# Altium schematic sheet PWM.SchDoc
size A4; SheetNumber: 2; SheetTotal: 4
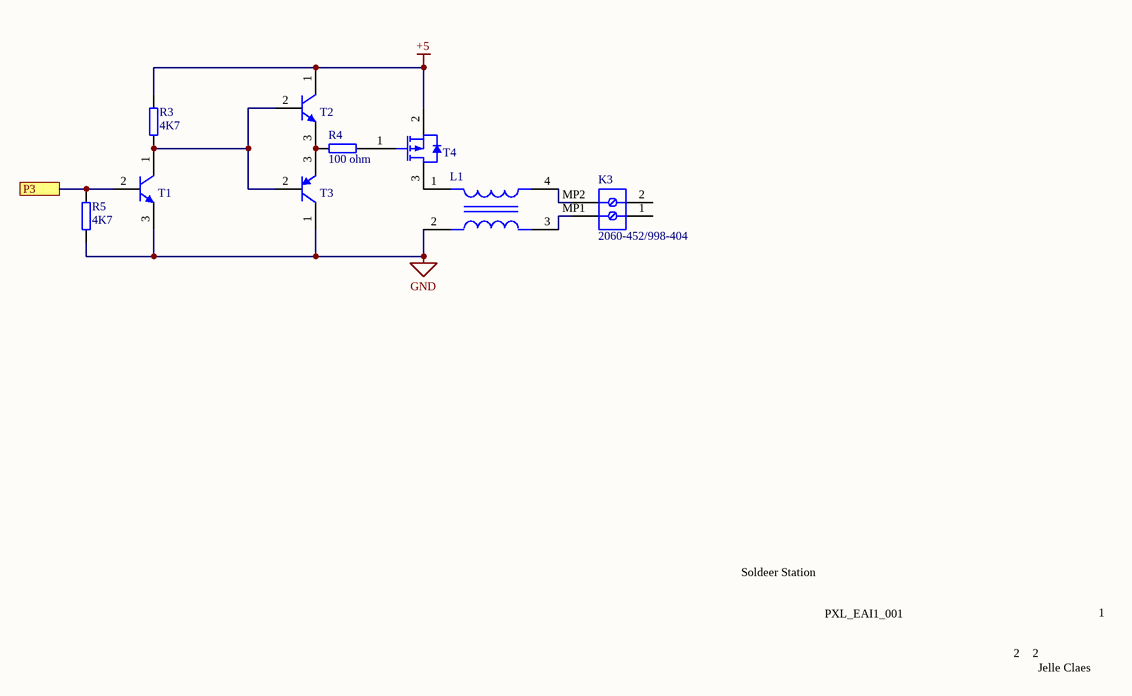
[diagram p0: PWM.SchDoc]

## Parts
K3  2060-452/998-404  [WAGO-2060-452_V]
L1  Common_Mode_Choke  [2545]  (value not drawn)
R3  4K7  [R_0805_M]
R4  100 ohm  [R_0805_M]
R5  4K7  [R_0805_M]
T1  Transistor_NPN  [SOT_23]  (value not drawn)
T2  Transistor_NPN  [SOT_23]  (value not drawn)
T3  Transistor_PNP  [SOT_23]  (value not drawn)
T4  MOSFET_P  [TO_252]  (value not drawn)

## Ports
P3 (see CPU[2B])

## Nets
+5: R3.2 T2.1(C) T4.2(DRAIN)
GND: L1.2 R5.1 T1.3(E) T3.1(C)
P3: R5.2 T1.2(B) ; port P3
NetK3_MP1: K3.MP1 L1.3
NetK3_MP2: K3.MP2 L1.4
NetL1_1: L1.1 T4.3(SOURCE)
NetR3_1: R3.1 T1.1(C) T2.2(B) T3.2(B)
NetR4_1: R4.1 T4.1(GATE)
NetR4_2: R4.2 T2.3(E) T3.3(E)

Not connected (* = marked no-connect by the designer): K3 1 2

## Notes on the sheet
- Soldeer Station
- PXL_EAI1_001
- 2
- 1
- Jelle Claes

## Library data of the parts
K3 = WAGO-2060: Terminal Block, Pitch 4 mm, 1 x 2 Position, Height 4.5 mm, -60 to 105 degC, RoHS, Tape and Reel; Manufacturer: WAGO; Number of contacts: 2; Content: 1pc(s); Min. cross section (flexible): 0.25mm²; Stripping length: 6-7mm; Nominal current: 9A; Nominal voltage: 160V; Pitch: 4mm; Min. cross section (unflexible): 0.2mm²; Max. cross section (inflexible): 0.75mm²; AWG: 24-18; Connection: Pullspring; Type: 2060-452/998-404; Package Reference: 2060-452; Mounting Technology: SurfaceMount; Colour: White; Package Description: Terminal Block, Pitch 4 mm, 1 x 2 Position, Height 4.5 mm; Height: 4.5mm; Manufacturer URL: http://global.wago.com/en/index-en.jsp; Material: PPA-GFenclosure·Tin-platedcoppercontacts; Width: 10.1mm; Manufacturer part No.: 2060-452/998-404; Datasheet URL: http://www.wago.com/infomaterial/pdf/60255126.pdf; Contact material: Tinplated; Length: 7.9mm; Max. cross section (flexible): 0.75mm²; Datasheet Version: 03/2015
L1 = Common_Mode_Choke: Max Current Rating: 2A; Number of Lines: 2; Impedance: 900R; Element Configuration: Dual; Insulation Resistance: 10MR; Test Frequency: 100MHz; DC Resistance (DCR): 60mR; Voltage Rating (DC): 50V; Current Rating: 2.3A; Number of Pins: 4; DC Current: 2A; Mount: Surface Mount; Current: 2A; REACH SVHC: No SVHC; Width: 4.5mm; Case/Package: 1808; Voltage Rating: 50V; Package Quantity: 1; Height: 2mm; Max DC Current: 2A; Packaging: Tape and Reel; Max Operating Temperature: 85°C; Lead Free: Lead Free; Length: 0.185inch; Series: ACM; Radiation Hardening: No; Max Voltage Rating (DC): 50V; Termination: Flat; Depth: 4.7mm; RoHS Compliant: Yes; DC Resistance-Max: 60mR; Min Operating Temperature: -40°C
R3-R5 = Resistor: Manufacturer: Vishay Dale; Part Number: CRCW08050000Z0EA
T1 T2 = Transistor_NPN: Manufacturer: On Semiconductor; PartNumber: BC547C; IC Continuous (A): 0.1; fT Min (MHz): 150; Packing: Bulk Box; Polarity: NPN; Mounting Technology: Through Hole; ComponentLink1URL: http://www.onsemi.com/; ComponentLink1Description: Manufacturer URL; ComponentLink3URL: http://www.onsemi.cn/pub_link/Collateral/2N6426-D.PDF; DatasheetVersion: Rev. 7; PackageVersion: Rev. AM; RoHS: FALSE; ComponentLink2URL: http://www.onsemi.com/pub_link/Collateral/BC546-D.PDF; ComponentLink3Description: Package Specification; PackageDescription: 3-Pin Transistor Outline, Body 4.825 x 3.685 mm, Pitch 1.27 mm; PackageReference: TO-92-3-29-11_AM_SL; ComponentLink2Description: Datasheet
T3 = Transistor_PNP: Manufacturer: On Semiconductor; PartNumber: BC557C; Polarity: PNP; IC Continuous (A): -0.1; Packing: Bulk Box; PackageVersion: Rev. AM; RoHS: FALSE; PackageDescription: 3-Pin Transistor Outline, Body 4.825 x 3.685 mm, Pitch 1.27 mm; ComponentLink2Description: Datasheet; DatasheetVersion: Rev. 3; ComponentLink3Description: Package Specification; Mounting Technology: Through Hole; ComponentLink2URL: http://www.onsemi.com/pub_link/Collateral/BC556B-D.PDF; ComponentLink1URL: http://www.onsemi.com/; ComponentLink1Description: Manufacturer URL; ComponentLink3URL: http://www.onsemi.cn/pub_link/Collateral/2N6426-D.PDF; PackageReference: TO-92-3-29-11_AM_SL
T4 = MOSFET_P: Manufacturer: Fairchild Semiconductor; Reel Quantity: 3000; Drain Source Voltage Vds: 20V; Power Dissipation Pd: 500mW; On Resistance Rds(on): 52mohm; Full Power Rating Temperature: 25°C; Voltage Vgs Max: -800mV; Pulse Current Idm: 10A; Rds(on) Test Voltage Vgs: -4.5V; External Depth: 2.5mm; Transistor Case Style: SOT-23; No. of Pins: 3; Continuous Drain Current Id: 2.4A; Voltage Vds Typ: -20V; Voltage Vgs th Max: -1.5V; Transistor Polarity: PChannel; Package Version: Rev. 3, 05/2015; External Width: 3.05mm; External Length / Height: 1.12mm; SMD Marking: 304P; SVHC: NoSVHC(19-Dec-2012); Termination Type: SMD; Datasheet URL: https://www.fairchildsemi.com/datasheets/FD/FDN304P.pdf; Tape Width: 8mm; Mounting Technology: SurfaceMount; Voltage Vgs Rds on Measurement: -4.5V; Operating Temperature Range: -55°Cto+150°C; Current Temperature: 25°C; Operating Temperature Min: -55°C; Threshold Voltage Vgs Typ: -800mV; Package / Case: SOT-23; Manufacturer URL: https://www.fairchildsemi.com/; Voltage Vds: 20V; Datasheet Version: Rev. C, 01/2001; Operating Temperature Max: 150°C; Package Description: 3-Pin Small Outline Transistor, Body 2.92 x 1.4 mm, Pitch 0.95 mm; Current Id Max: 2.4A; Package URL: https://www.fairchildsemi.com/package-drawings/MA/MA03B.pdf; Package Reference: SSOT3L